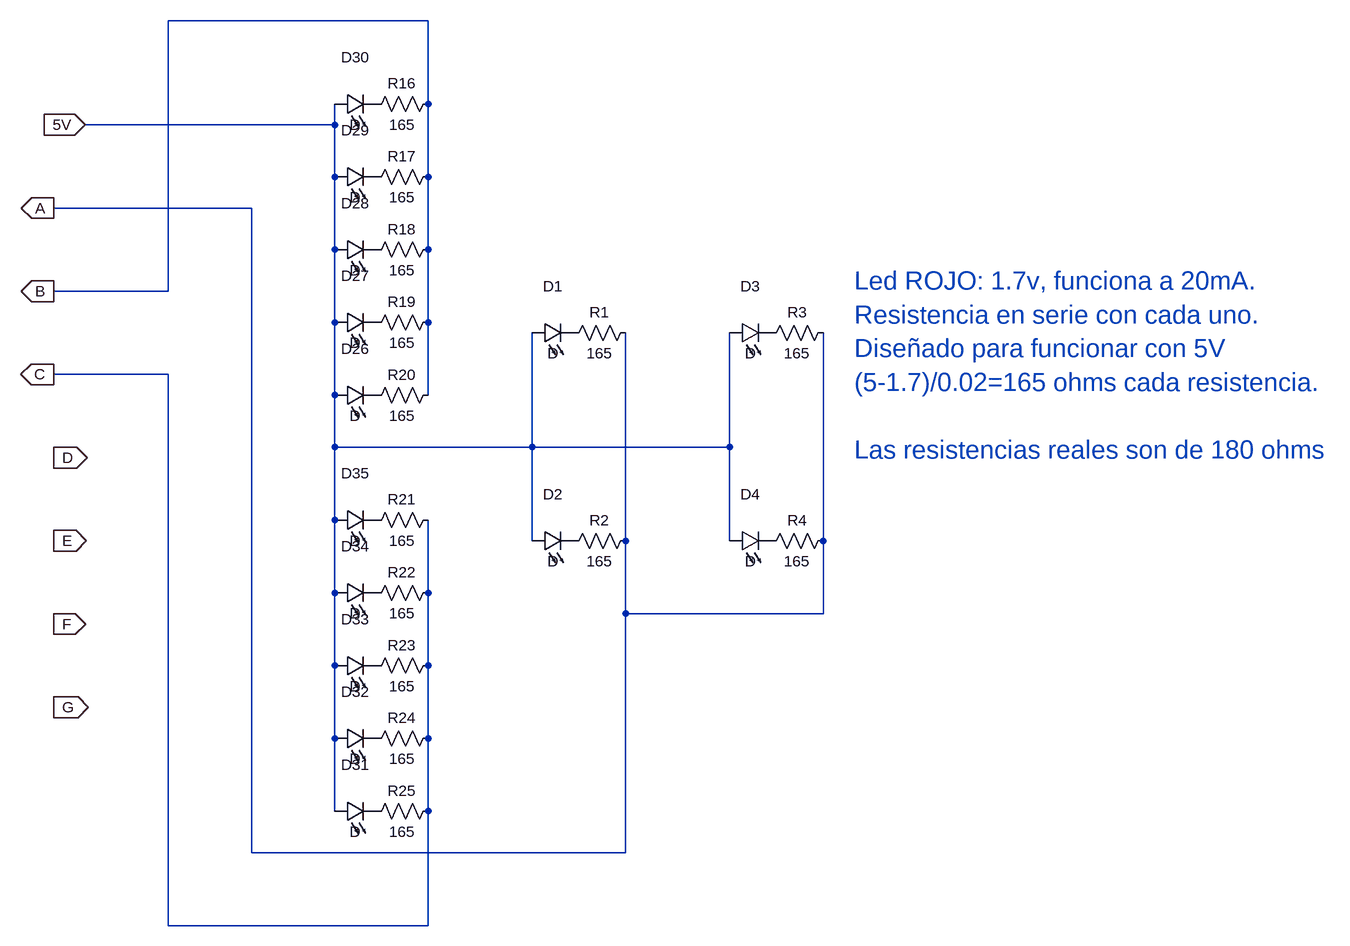
[diagram p0: schematic Display 7 segmentos ESPECIAL.asc]
Display 7 segmentos ESPECIAL.asc, the LTspice schematic file:
Version 4
SHEET 1 1560 1508
WIRE 32 -64 -368 -64
WIRE 32 64 32 -64
WIRE -112 96 -112 64
WIRE -112 96 -496 96
WIRE -112 176 -112 96
WIRE 32 176 32 64
WIRE -240 224 -544 224
WIRE -112 288 -112 176
WIRE 32 288 32 176
WIRE -368 352 -368 -64
WIRE -368 352 -544 352
WIRE -112 400 -112 288
WIRE 32 400 32 288
WIRE -368 480 -544 480
WIRE -112 512 -112 400
WIRE 32 512 32 400
WIRE -112 592 -112 512
WIRE 192 592 192 416
WIRE 192 592 -112 592
WIRE 496 592 496 416
WIRE 496 592 192 592
WIRE -112 704 -112 592
WIRE 192 736 192 592
WIRE 336 736 336 416
WIRE 496 736 496 592
WIRE 640 736 640 416
WIRE -112 816 -112 704
WIRE 32 816 32 704
WIRE 336 848 336 736
WIRE 640 848 640 736
WIRE 640 848 336 848
WIRE -112 928 -112 816
WIRE 32 928 32 816
WIRE -112 1040 -112 928
WIRE 32 1040 32 928
WIRE -112 1152 -112 1040
WIRE 32 1152 32 1040
WIRE -240 1216 -240 224
WIRE 336 1216 336 848
WIRE 336 1216 -240 1216
WIRE -368 1328 -368 480
WIRE 32 1328 32 1152
WIRE 32 1328 -368 1328
FLAG -496 96 5V
IOPIN -496 96 In
FLAG -544 224 A
IOPIN -544 224 Out
FLAG -544 352 B
IOPIN -544 352 Out
FLAG -544 480 C
IOPIN -544 480 Out
FLAG -544 608 D
IOPIN -544 608 Out
FLAG -544 736 E
IOPIN -544 736 Out
FLAG -544 864 F
IOPIN -544 864 Out
FLAG -544 992 G
IOPIN -544 992 Out
SYMBOL LED -112 528 R270
WINDOW 0 72 32 VTop 2
WINDOW 3 0 32 VBottom 2
SYMATTR InstName D26
SYMBOL LED -112 416 R270
WINDOW 0 72 32 VTop 2
WINDOW 3 0 32 VBottom 2
SYMATTR InstName D27
SYMBOL LED -112 304 R270
WINDOW 0 72 32 VTop 2
WINDOW 3 0 32 VBottom 2
SYMATTR InstName D28
SYMBOL LED -112 192 R270
WINDOW 0 72 32 VTop 2
WINDOW 3 0 32 VBottom 2
SYMATTR InstName D29
SYMBOL LED -112 80 R270
WINDOW 0 72 32 VTop 2
WINDOW 3 0 32 VBottom 2
SYMATTR InstName D30
SYMBOL LED -112 1168 R270
WINDOW 0 72 32 VTop 2
WINDOW 3 0 32 VBottom 2
SYMATTR InstName D31
SYMBOL LED -112 1056 R270
WINDOW 0 72 32 VTop 2
WINDOW 3 0 32 VBottom 2
SYMATTR InstName D32
SYMBOL LED -112 944 R270
WINDOW 0 72 32 VTop 2
WINDOW 3 0 32 VBottom 2
SYMATTR InstName D33
SYMBOL LED -112 832 R270
WINDOW 0 72 32 VTop 2
WINDOW 3 0 32 VBottom 2
SYMATTR InstName D34
SYMBOL LED -112 720 R270
WINDOW 0 72 32 VTop 2
WINDOW 3 0 32 VBottom 2
SYMATTR InstName D35
SYMBOL res 48 48 R90
WINDOW 0 0 56 VBottom 2
WINDOW 3 32 56 VTop 2
SYMATTR InstName R16
SYMATTR Value 165
SYMATTR SpiceLine tol=5 pwr=1/4
SYMBOL res 48 160 R90
WINDOW 0 0 56 VBottom 2
WINDOW 3 32 56 VTop 2
SYMATTR InstName R17
SYMATTR Value 165
SYMATTR SpiceLine tol=5 pwr=1/4
SYMBOL res 48 272 R90
WINDOW 0 0 56 VBottom 2
WINDOW 3 32 56 VTop 2
SYMATTR InstName R18
SYMATTR Value 165
SYMATTR SpiceLine tol=5 pwr=1/4
SYMBOL res 48 384 R90
WINDOW 0 0 56 VBottom 2
WINDOW 3 32 56 VTop 2
SYMATTR InstName R19
SYMATTR Value 165
SYMATTR SpiceLine tol=5 pwr=1/4
SYMBOL res 48 496 R90
WINDOW 0 0 56 VBottom 2
WINDOW 3 32 56 VTop 2
SYMATTR InstName R20
SYMATTR Value 165
SYMATTR SpiceLine tol=5 pwr=1/4
SYMBOL res 48 688 R90
WINDOW 0 0 56 VBottom 2
WINDOW 3 32 56 VTop 2
SYMATTR InstName R21
SYMATTR Value 165
SYMATTR SpiceLine tol=5 pwr=1/4
SYMBOL res 48 800 R90
WINDOW 0 0 56 VBottom 2
WINDOW 3 32 56 VTop 2
SYMATTR InstName R22
SYMATTR Value 165
SYMATTR SpiceLine tol=5 pwr=1/4
SYMBOL res 48 912 R90
WINDOW 0 0 56 VBottom 2
WINDOW 3 32 56 VTop 2
SYMATTR InstName R23
SYMATTR Value 165
SYMATTR SpiceLine tol=5 pwr=1/4
SYMBOL res 48 1024 R90
WINDOW 0 0 56 VBottom 2
WINDOW 3 32 56 VTop 2
SYMATTR InstName R24
SYMATTR Value 165
SYMATTR SpiceLine tol=5 pwr=1/4
SYMBOL res 48 1136 R90
WINDOW 0 0 56 VBottom 2
WINDOW 3 32 56 VTop 2
SYMATTR InstName R25
SYMATTR Value 165
SYMATTR SpiceLine tol=5 pwr=1/4
SYMBOL LED 192 432 R270
WINDOW 0 72 32 VTop 2
WINDOW 3 0 32 VBottom 2
SYMATTR InstName D1
SYMBOL res 352 400 R90
WINDOW 0 0 56 VBottom 2
WINDOW 3 32 56 VTop 2
SYMATTR InstName R1
SYMATTR Value 165
SYMATTR SpiceLine tol=5 pwr=1/4
SYMBOL LED 192 752 R270
WINDOW 0 72 32 VTop 2
WINDOW 3 0 32 VBottom 2
SYMATTR InstName D2
SYMBOL res 352 720 R90
WINDOW 0 0 56 VBottom 2
WINDOW 3 32 56 VTop 2
SYMATTR InstName R2
SYMATTR Value 165
SYMATTR SpiceLine tol=5 pwr=1/4
SYMBOL LED 496 432 R270
WINDOW 0 72 32 VTop 2
WINDOW 3 0 32 VBottom 2
SYMATTR InstName D3
SYMBOL res 656 400 R90
WINDOW 0 0 56 VBottom 2
WINDOW 3 32 56 VTop 2
SYMATTR InstName R3
SYMATTR Value 165
SYMATTR SpiceLine tol=5 pwr=1/4
SYMBOL LED 496 752 R270
WINDOW 0 72 32 VTop 2
WINDOW 3 0 32 VBottom 2
SYMATTR InstName D4
SYMBOL res 656 720 R90
WINDOW 0 0 56 VBottom 2
WINDOW 3 32 56 VTop 2
SYMATTR InstName R4
SYMATTR Value 165
SYMATTR SpiceLine tol=5 pwr=1/4
TEXT 688 336 Left 4 ;Led ROJO: 1.7v, funciona a 20mA.\nResistencia en serie con cada uno.\nDiseñado para funcionar con 5V\n(5-1.7)/0.02=165 ohms cada resistencia.\n \nLas resistencias reales son de 180 ohms

The netlist it stands for:
* Display 7 segmentos ESPECIAL.asc
D26 5V P001 D
D27 5V P002 D
D28 5V P003 D
D29 5V P004 D
D30 5V P005 D
D31 5V P006 D
D32 5V P007 D
D33 5V P008 D
D34 5V P009 D
D35 5V P010 D
R16 B P005 165 tol=5 pwr=1/4
R17 B P004 165 tol=5 pwr=1/4
R18 B P003 165 tol=5 pwr=1/4
R19 B P002 165 tol=5 pwr=1/4
R20 B P001 165 tol=5 pwr=1/4
R21 C P010 165 tol=5 pwr=1/4
R22 C P009 165 tol=5 pwr=1/4
R23 C P008 165 tol=5 pwr=1/4
R24 C P007 165 tol=5 pwr=1/4
R25 C P006 165 tol=5 pwr=1/4
D1 5V P011 D
R1 A P011 165 tol=5 pwr=1/4
D2 5V P012 D
R2 A P012 165 tol=5 pwr=1/4
D3 5V P013 D
R3 A P013 165 tol=5 pwr=1/4
D4 5V P014 D
R4 A P014 165 tol=5 pwr=1/4
.model D D
.lib standard.dio
* Led ROJO: 1.7v, funciona a 20mA.
* Resistencia en serie con cada uno.
* Diseñado para funcionar con 5V
* (5-1.7)/0.02=165 ohms cada resistencia.
* Las resistencias reales son de 180 ohms
.backanno
.end